# Altium schematic sheet IMX6ULL_CORE_sch2.SchDoc
size A4
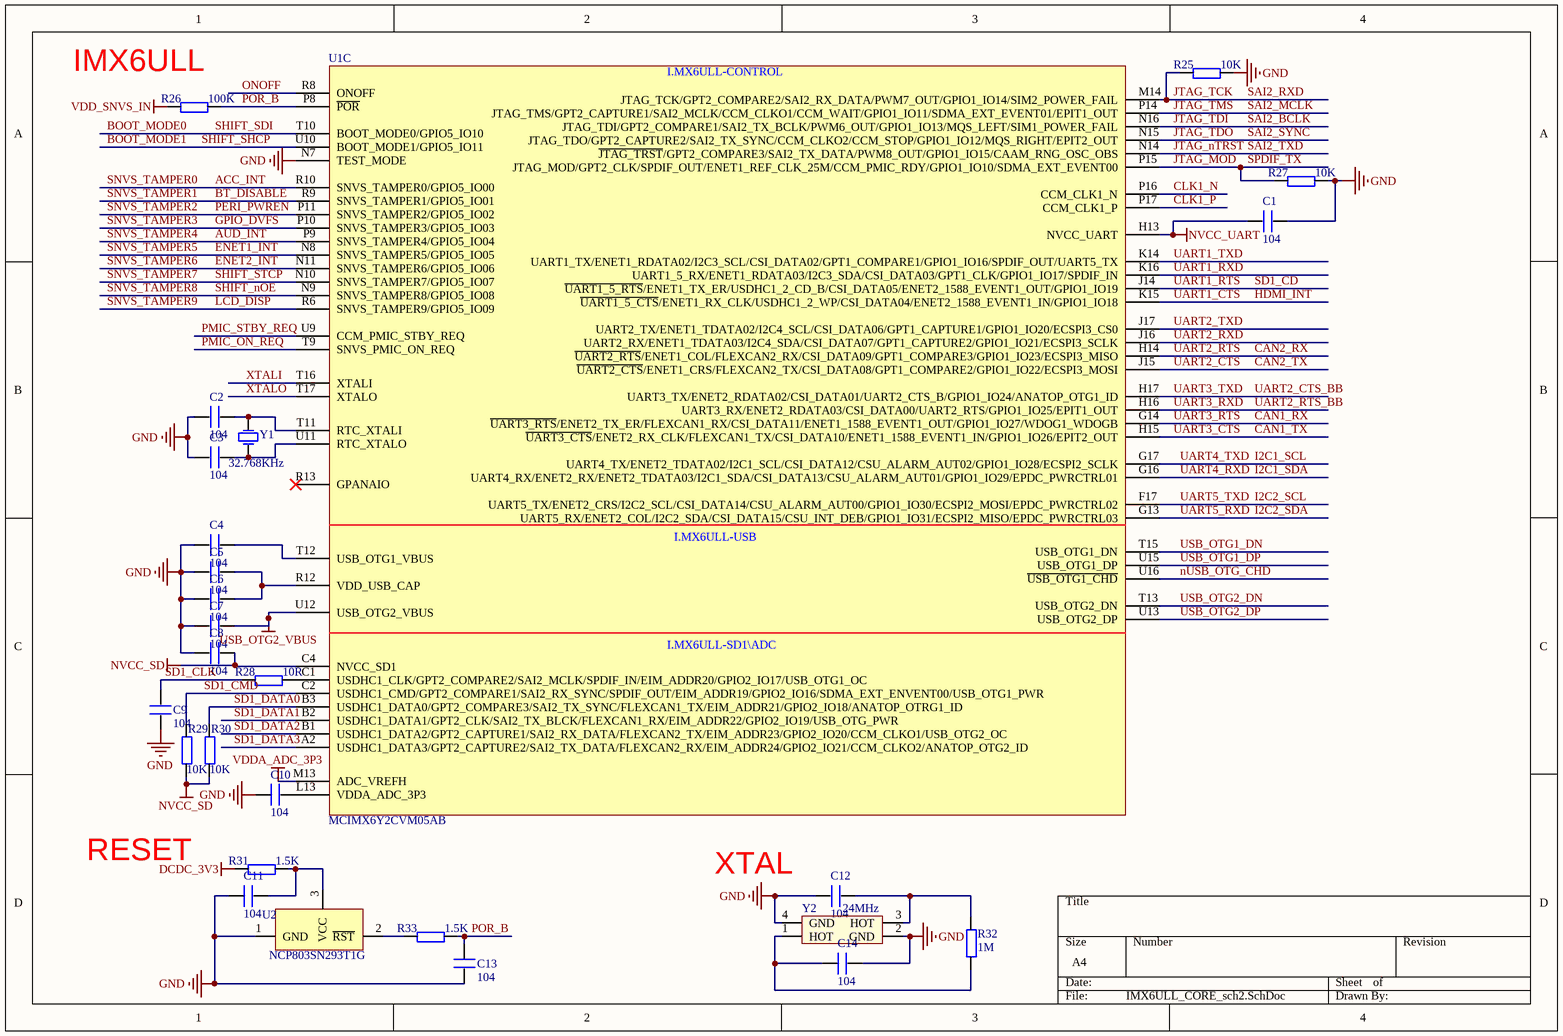
[diagram p0: IMX6ULL_CORE_sch2.SchDoc]

## Parts
C1  104  [C 0402]
C2  104  [C 0402]
C3  104  [C 0402]
C4  104  [C 0402]
C5  104  [C 0402]
C6  104  [C 0402]
C7  104  [C 0402]
C8  104  [C 0402]
C9  104  [C 0402]
C10  104  [C 0402]
C11  104  [C 0402]
C12  104  [C 0402]
C13  104  [C 0402]
C14  104  [C 0402]
R25  10K  [R 0402]
R26  100K  [R 0402]
R27  10K  [R 0402]
R28  10R  [R 0402]
R29  10K  [R 0402]
R30  10K  [R 0402]
R31  1.5K  [R 0402]
R32  1M  [R 0402]
R33  1.5K  [R 0402]
U1  MCIMX6Y2CVM05AB  [BGA289C80P17X17_1400X1400X132]  (part C of 5)
U2  NCP803SN293T1G  [SOT23-3L]
Y1  32.768KHz  [XTAL-3215]
Y2  24MHz  [XTAL-3225]

## Nets
DCDC_3V3: R31.1
GND: C1.1 C2.2 C3.2 C4.2 C5.2 C6.1 C7.2 C8.2 C9.2 C10.1 C11.1 C12.2 C13.1 C14.1 R25.2 R27.2 U1.N7(TEST_MODE) U2.1(GND) Y2.2(GND) Y2.4(GND)
NVCC_SD: C8.1 R29.1 R30.1 U1.C4(NVCC_SD1)
NVCC_UART: C1.2 U1.H13(NVCC_UART)
USB_OTG2_VBUS: C7.1 U1.U12(USB_OTG2_VBUS)
VDD_SNVS_IN: R26.1
VDDA_ADC_3P3: U1.M13(ADC_VREFH)
ACC_INT: U1.R10(SNVS_TAMPER0/GPIO5_IO00)  [also labelled SNVS_TAMPER0]
AUD_INT: U1.P9(SNVS_TAMPER4/GPIO5_IO04)  [also labelled SNVS_TAMPER4]
BOOT_MODE0: U1.T10(BOOT_MODE0/GPIO5_IO10)  [also labelled SHIFT_SDI]
BOOT_MODE1: U1.U10(BOOT_MODE1/GPIO5_IO11)  [also labelled SHIFT_SHCP]
BT_DISABLE: U1.R9(SNVS_TAMPER1/GPIO5_IO01)  [also labelled SNVS_TAMPER1]
CAN1_RX: U1.G14(~{UART3_RTS}/ENET2_TX_ER/FLEXCAN1_RX/CSI_DATA11/ENET1_1588_EVENT1_OUT/GPIO1_IO27/WDOG1_WDOGB)  [also labelled UART3_RTS]
CAN1_TX: U1.H15(~{UART3_CTS}/ENET2_RX_CLK/FLEXCAN1_TX/CSI_DATA10/ENET1_1588_EVENT1_IN/GPIO1_IO26/EPIT2_OUT)  [also labelled UART3_CTS]
CAN2_RX: U1.H14(~{UART2_RTS}/ENET1_COL/FLEXCAN2_RX/CSI_DATA09/GPT1_COMPARE3/GPIO1_IO23/ECSPI3_MISO)  [also labelled UART2_RTS]
CAN2_TX: U1.J15(~{UART2_CTS}/ENET1_CRS/FLEXCAN2_TX/CSI_DATA08/GPT1_COMPARE2/GPIO1_IO22/ECSPI3_MOSI)  [also labelled UART2_CTS]
CLK1_N: U1.P16(CCM_CLK1_N)
CLK1_P: U1.P17(CCM_CLK1_P)
ENET1_INT: U1.N8(SNVS_TAMPER5/GPIO5_IO05)  [also labelled SNVS_TAMPER5]
ENET2_INT: U1.N11(SNVS_TAMPER6/GPIO5_IO06)  [also labelled SNVS_TAMPER6]
GPIO_DVFS: U1.P10(SNVS_TAMPER3/GPIO5_IO03)  [also labelled SNVS_TAMPER3]
HDMI_INT: U1.K15(~{UART1_5_CTS}/ENET1_RX_CLK/USDHC1_2_WP/CSI_DATA04/ENET2_1588_EVENT1_IN/GPIO1_IO18)  [also labelled UART1_CTS]
I2C1_SCL: U1.G17(UART4_TX/ENET2_TDATA02/I2C1_SCL/CSI_DATA12/CSU_ALARM_AUT02/GPIO1_IO28/ECSPI2_SCLK)  [also labelled UART4_TXD]
I2C1_SDA: U1.G16(UART4_RX/ENET2_RX/ENET2_TDATA03/I2C1_SDA/CSI_DATA13/CSU_ALARM_AUT01/GPIO1_IO29/EPDC_PWRCTRL01)  [also labelled UART4_RXD]
I2C2_SCL: U1.F17(UART5_TX/ENET2_CRS/I2C2_SCL/CSI_DATA14/CSU_ALARM_AUT00/GPIO1_IO30/ECSPI2_MOSI/EPDC_PWRCTRL02)  [also labelled UART5_TXD]
I2C2_SDA: U1.G13(UART5_RX/ENET2_COL/I2C2_SDA/CSI_DATA15/CSU_INT_DEB/GPIO1_IO31/ECSPI2_MISO/EPDC_PWRCTRL03)  [also labelled UART5_RXD]
JTAG_MOD: R27.1 U1.P15(JTAG_MOD/GPT2_CLK/SPDIF_OUT/ENET1_REF_CLK_25M/CCM_PMIC_RDY/GPIO1_IO10/SDMA_EXT_EVENT00)  [also labelled SPDIF_TX]
JTAG_nTRST: U1.N14(~{JTAG_TRST}/GPT2_COMPARE3/SAI2_TX_DATA/PWM8_OUT/GPIO1_IO15/CAAM_RNG_OSC_OBS)  [also labelled SAI2_TXD]
JTAG_TCK: R25.1 U1.M14(JTAG_TCK/GPT2_COMPARE2/SAI2_RX_DATA/PWM7_OUT/GPIO1_IO14/SIM2_POWER_FAIL)  [also labelled SAI2_RXD]
JTAG_TDI: U1.N16(JTAG_TDI/GPT2_COMPARE1/SAI2_TX_BCLK/PWM6_OUT/GPIO1_IO13/MQS_LEFT/SIM1_POWER_FAIL)  [also labelled SAI2_BCLK]
JTAG_TDO: U1.N15(JTAG_TDO/GPT2_CAPTURE2/SAI2_TX_SYNC/CCM_CLKO2/CCM_STOP/GPIO1_IO12/MQS_RIGHT/EPIT2_OUT)  [also labelled SAI2_SYNC]
JTAG_TMS: U1.P14(JTAG_TMS/GPT2_CAPTURE1/SAI2_MCLK/CCM_CLKO1/CCM_WAIT/GPIO1_IO11/SDMA_EXT_EVENT01/EPIT1_OUT)  [also labelled SAI2_MCLK]
LCD_DISP: U1.R6(SNVS_TAMPER9/GPIO5_IO09)  [also labelled SNVS_TAMPER9]
nUSB_OTG_CHD: U1.U16(~{USB_OTG1_CHD})
ONOFF: U1.R8(ONOFF)
PERI_PWREN: U1.P11(SNVS_TAMPER2/GPIO5_IO02)  [also labelled SNVS_TAMPER2]
PMIC_ON_REQ: U1.T9(SNVS_PMIC_ON_REQ)
PMIC_STBY_REQ: U1.U9(CCM_PMIC_STBY_REQ)
POR_B: C13.2 R26.2 R33.2 U1.P8(~{POR})
SD1_CD: U1.J14(~{UART1_5_}~{RTS}/ENET1_TX_ER/USDHC1_2_CD_B/CSI_DATA05/ENET2_1588_EVENT1_OUT/GPIO1_IO19)  [also labelled UART1_RTS]
SD1_CLK: C9.1 R28.1
SD1_CMD: R29.2 U1.C2(USDHC1_CMD/GPT2_COMPARE1/SAI2_RX_SYNC/SPDIF_OUT/EIM_ADDR19/GPIO2_IO16/SDMA_EXT_ENVENT00/USB_OTG1_PWR)
SD1_DATA0: R30.2 U1.B3(USDHC1_DATA0/GPT2_COMPARE3/SAI2_TX_SYNC/FLEXCAN1_TX/EIM_ADDR21/GPIO2_IO18/ANATOP_OTRG1_ID)
SD1_DATA1: U1.B2(USDHC1_DATA1/GPT2_CLK/SAI2_TX_BLCK/FLEXCAN1_RX/EIM_ADDR22/GPIO2_IO19/USB_OTG_PWR)
SD1_DATA2: U1.B1(USDHC1_DATA2/GPT2_CAPTURE1/SAI2_RX_DATA/FLEXCAN2_TX/EIM_ADDR23/GPIO2_IO20/CCM_CLKO1/USB_OTG2_OC)
SD1_DATA3: U1.A2(USDHC1_DATA3/GPT2_CAPTURE2/SAI2_TX_DATA/FLEXCAN2_RX/EIM_ADDR24/GPIO2_IO21/CCM_CLKO2/ANATOP_OTG2_ID)
SHIFT_nOE: U1.N9(SNVS_TAMPER8/GPIO5_IO08)  [also labelled SNVS_TAMPER8]
SHIFT_STCP: U1.N10(SNVS_TAMPER7/GPIO5_IO07)  [also labelled SNVS_TAMPER7]
UART1_RXD: U1.K16(UART1_5_RX/ENET1_RDATA03/I2C3_SDA/CSI_DATA03/GPT1_CLK/GPIO1_IO17/SPDIF_IN)
UART1_TXD: U1.K14(UART1_TX/ENET1_RDATA02/I2C3_SCL/CSI_DATA02/GPT1_COMPARE1/GPIO1_IO16/SPDIF_OUT/UART5_TX)
UART2_CTS_BB: U1.H17(UART3_TX/ENET2_RDATA02/CSI_DATA01/UART2_CTS_B/GPIO1_IO24/ANATOP_OTG1_ID)  [also labelled UART3_TXD]
UART2_RTS_BB: U1.H16(UART3_RX/ENET2_RDATA03/CSI_DATA00/UART2_RTS/GPIO1_IO25/EPIT1_OUT)  [also labelled UART3_RXD]
UART2_RXD: U1.J16(UART2_RX/ENET1_TDATA03/I2C4_SDA/CSI_DATA07/GPT1_CAPTURE2/GPIO1_IO21/ECSPI3_SCLK)
UART2_TXD: U1.J17(UART2_TX/ENET1_TDATA02/I2C4_SCL/CSI_DATA06/GPT1_CAPTURE1/GPIO1_IO20/ECSPI3_CS0)
USB_OTG1_DN: U1.T15(USB_OTG1_DN)
USB_OTG1_DP: U1.U15(USB_OTG1_DP)
USB_OTG2_DN: U1.T13(USB_OTG2_DN)
USB_OTG2_DP: U1.U13(USB_OTG2_DP)
XTALI: U1.T16(XTALI)
XTALO: U1.T17(XTALO)
NetC2_1: C2.1 U1.T11(RTC_XTALI) Y1.2(OSC2)
NetC3_1: C3.1 U1.U11(RTC_XTALO) Y1.1(OSC1)
NetC4_1: C4.1 U1.T12(USB_OTG1_VBUS)
NetC5_1: C5.1 C6.2 U1.R12(VDD_USB_CAP)
NetC10_2: C10.2 U1.L13(VDDA_ADC_3P3)
NetC11_2: C11.2 R31.2 U2.3(VCC)
NetC12_1: C12.1 R32.2 Y2.3(HOT)
NetC14_2: C14.2 R32.1 Y2.1(HOT)
NetR28_2: R28.2 U1.C1(USDHC1_CLK/GPT2_COMPARE2/SAI2_MCLK/SPDIF_IN/EIM_ADDR20/GPIO2_IO17/USB_OTG1_OC)
NetR33_1: R33.1 U2.2(~{RST})

Not connected (* = marked no-connect by the designer): U1 R13(GPANAIO)*

## Notes on the sheet
- (near R26) IMX6ULL
- RESET
- XTAL
- (in symbol MCIMX6Y2CVM05AB, part C) I.MX6ULL-CONTROL; I.MX6ULL-USB; I.MX6ULL-SD1\ADC

## Library data of the parts
C1-C14 = C
R25-R33 = R
Y1 = XTAL: 普通晶振; Published: 8-Jun-2000; LatestRevisionDate: 17-Jul-2002; LatestRevisionNote: Re-released for DXP Platform.; Publisher: Altium Limited
Y2 = XTAL_3225: 3225贴片无源晶振